# EAGLE design circuit (EAGLE 6.1)
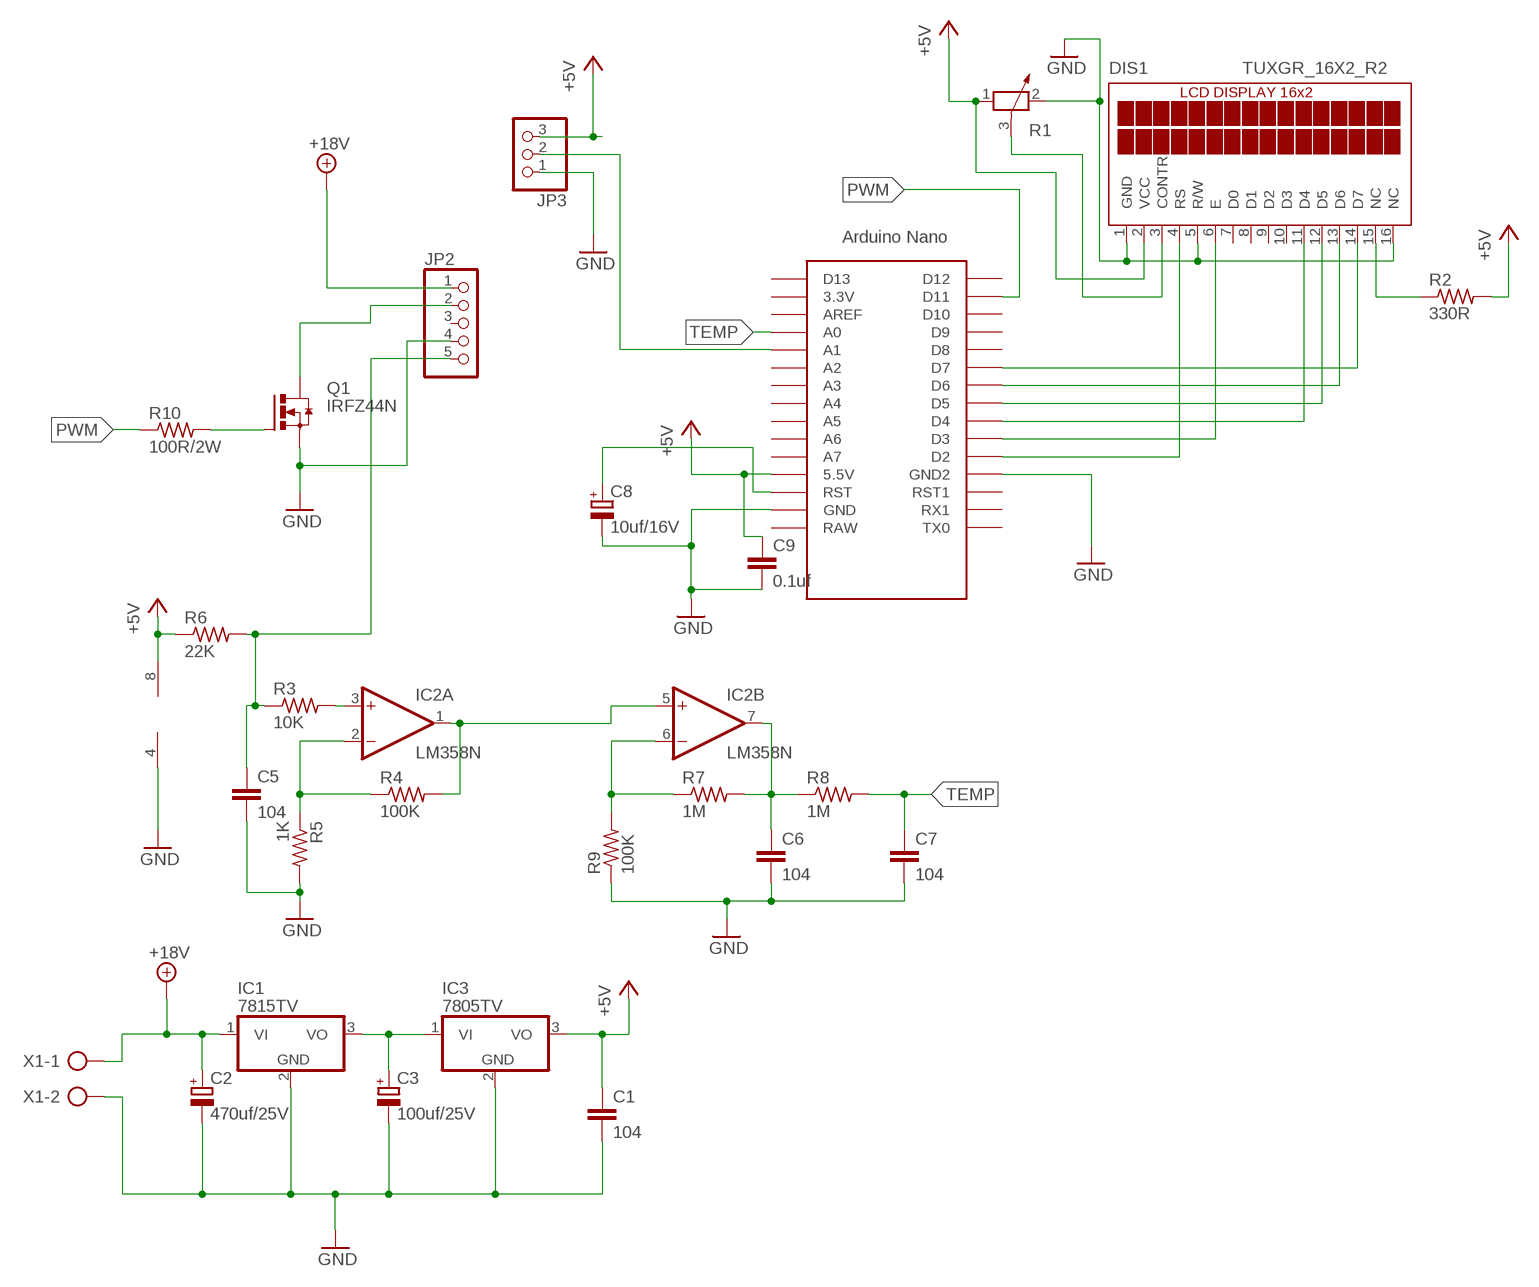
[diagram p0: schematic, sheet 1]

## Parts
C1  104  C-EU025-025X050  [C025-025X050]
C2  470uf/25V  CPOL-EUE2.5-7  [E2,5-7]
C3  100uf/25V  CPOL-EUE2.5-6  [E2,5-6]
C5  104  C-EU025-025X050  [C025-025X050]
C6  104  C-EU025-025X050  [C025-025X050]
C7  104  C-EU025-025X050  [C025-025X050]
C8  10uf/16V  CPOL-EUE2-5  [E2-5]
C9  0.1uf  C-EU025-040X050  [C025-040X050]
DIS1  TUXGR_16X2_R2  [TUXGR_16X2_R2]
IC1  7815TV  [TO220V]
IC2  LM358N  [DIL08]
IC3  7805TV  [TO220V]
JP2  PINHD-1X5  [1X05]
JP3  PINHD-1X3  [1X03]
Q1  IRFZ44N  [TO220BV]
R1  POTENTIOMETER_PT-10  [PT-10]
R2  330R  R-US_0207/10  [0207/10]
R3  10K  R-US_0207/10  [0207/10]
R4  100K  R-US_0207/10  [0207/10]
R5  1K  R-US_0207/10  [0207/10]
R6  22K  R-US_0207/10  [0207/10]
R7  1M  R-US_0207/10  [0207/10]
R8  1M  R-US_0207/10  [0207/10]
R9  100K  R-US_0207/10  [0207/10]
R10  100R/2W  R-US_0411/15  [0411/15]
U$2  NANO  [NANO]
X1  AK500/2  [AK500/2]

## Nets
+5V: C1.1 C9.1 DIS1.2(VCC) IC2.8(P:V+) IC3.3(VO) JP3.3 R1.1 R2.2 R6.1 U$2.5V(5.5V)
+18V: C2.+ IC1.1(VI) JP2.1 X1.1
GND: C1.2 C2.- C3.- C5.2 C6.2 C7.2 C8.- C9.2 DIS1.1(GND) DIS1.5(R/W) DIS1.16(NC) IC1.2(GND) IC2.4(P:V-) IC3.2(GND) JP2.4 JP3.1 Q1.S R1.2 R5.2 R9.1 U$2.GND U$2.GND1(GND2) X1.2
N$1: JP2.2 Q1.D
N$2: IC2.1(A:OUT) IC2.5(B:+IN) R4.2
N$3: C3.+ IC1.3(VO) IC3.1(VI)
N$4: IC2.2(A:-IN) R4.1 R5.1
N$5: IC2.3(A:+IN) R3.2
N$6: DIS1.4(RS) U$2.D2
N$7: C5.1 JP2.5 R3.1 R6.2
N$8: JP3.2 U$2.A1
N$9: IC2.6(B:-IN) R7.1 R9.2
N$10: C6.1 IC2.7(B:OUT) R7.2 R8.1
N$11: Q1.G R10.2
N$12: DIS1.6(E) U$2.D3
N$14: C8.+ U$2.RST
N$16: DIS1.11(D4) U$2.D4
N$17: DIS1.12(D5) U$2.D5
N$18: DIS1.13(D6) U$2.D6
N$19: DIS1.14(D7) U$2.D7
N$20: DIS1.3(CONTR) R1.3
N$25: DIS1.15(NC) R2.1
PWM: R10.1 U$2.D11
TEMP: C7.1 R8.2 U$2.A0
Unconnected: DIS1.7(D0) DIS1.8(D1) DIS1.9(D2) DIS1.10(D3) JP2.3 U$2.3.3V U$2.A2 U$2.A3 U$2.A4 U$2.A5 U$2.A6 U$2.A7 U$2.AREF U$2.D8 U$2.D9 U$2.D10 U$2.D12 U$2.D13 U$2.ICSP1 U$2.ICSP2 U$2.ICSP3 U$2.ICSP4 U$2.ICSP5 U$2.ICSP6 U$2.RAW U$2.RST1 U$2.RX1 U$2.TX0

## Library data of the parts
C1 C5-C7 C9 = rcl:C-EU: CAPACITOR, European symbol
C2 C3 C8 = rcl:CPOL-EU: POLARIZED CAPACITOR, European symbol
DIS1 = display-lcd:TUXGR_16X2_R2: Tuxgraphics LCD display 16x2 characters reflective, without background light Source: tuxgr_12x2_r2.pdf; OC_FARNELL: unknown; OC_NEWARK: unknown
IC1 IC3 = linear:78*: Positive VOLTAGE REGULATOR Source: http://cache.national.com/ds/LM/LM78L05.pdf http://www.fairchildsemi.com/ds/LM/LM7805.pdf
IC2 = linear:LM358: OP AMP also LM158; LM258; LM2904 Source: http://cache.national.com/ds/LM/LM158.pdf
JP2 = pinhead:PINHD-1X5: PIN HEADER
JP3 = pinhead:PINHD-1X3: PIN HEADER
Q1 = transistor-power:IRFZ44N: Aims Interactive IRFZ44 TYPE
R1 = rcl:POTENTIOMETER_: Potentiometer
R2-R10 = rcl:R-US_: RESISTOR, American symbol
U$2 = Arduino-clone:NANO: Arduino Nano
X1 = con-ptr500:AK500/2: CONNECTOR; OC_FARNELL: unknown; OC_NEWARK: unknown

## Net classes
0 default: clearance 1 mm

## Board
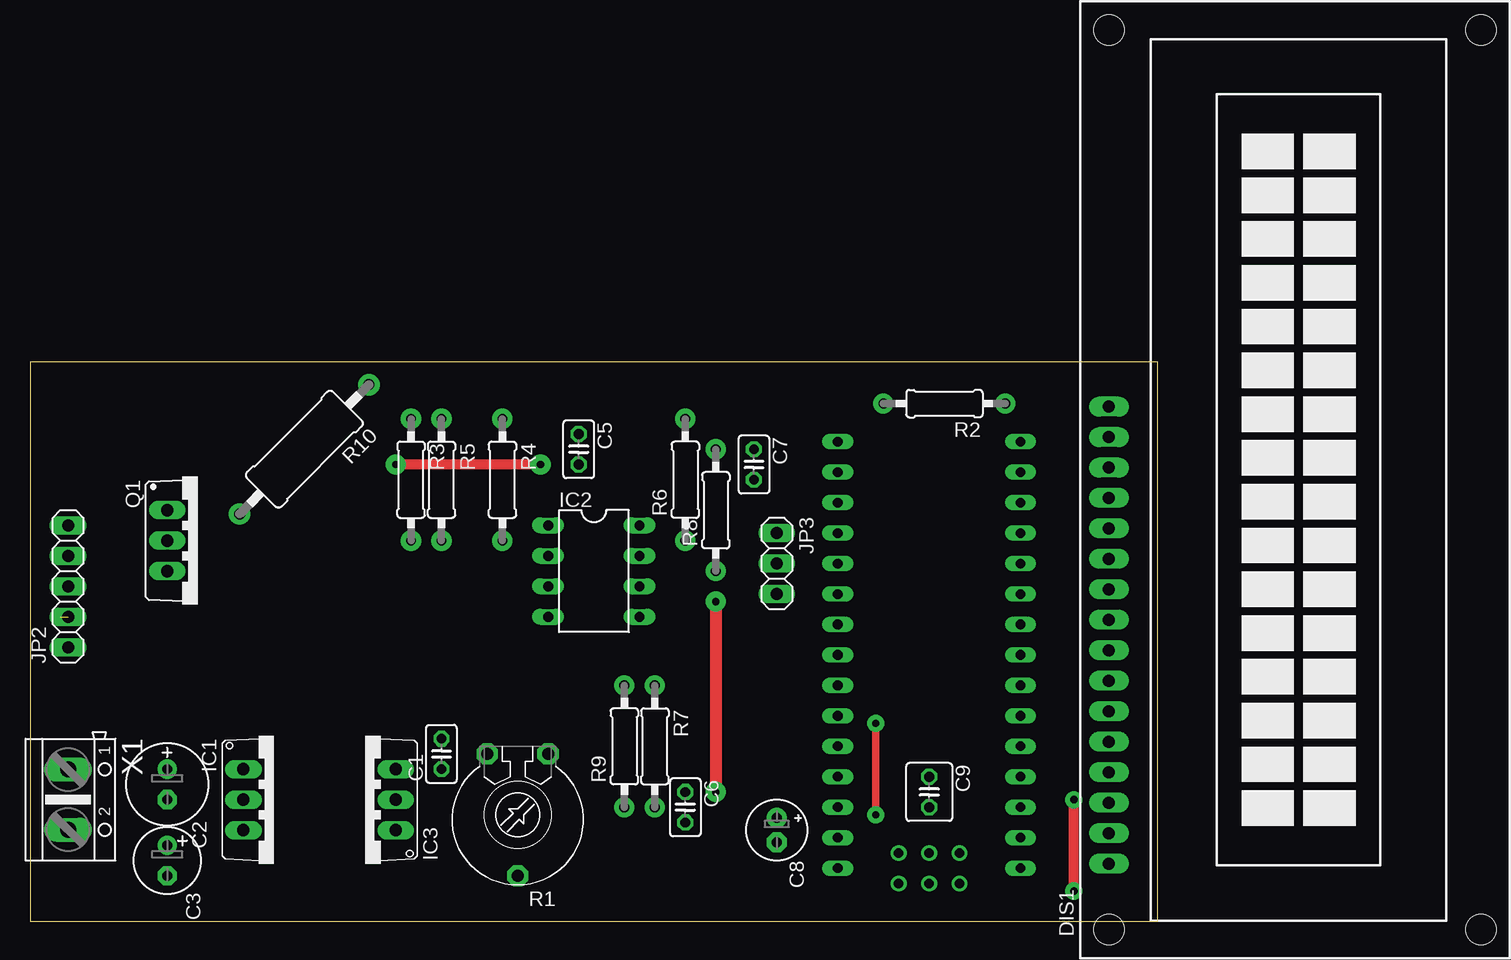
[diagram p1: board, top side]
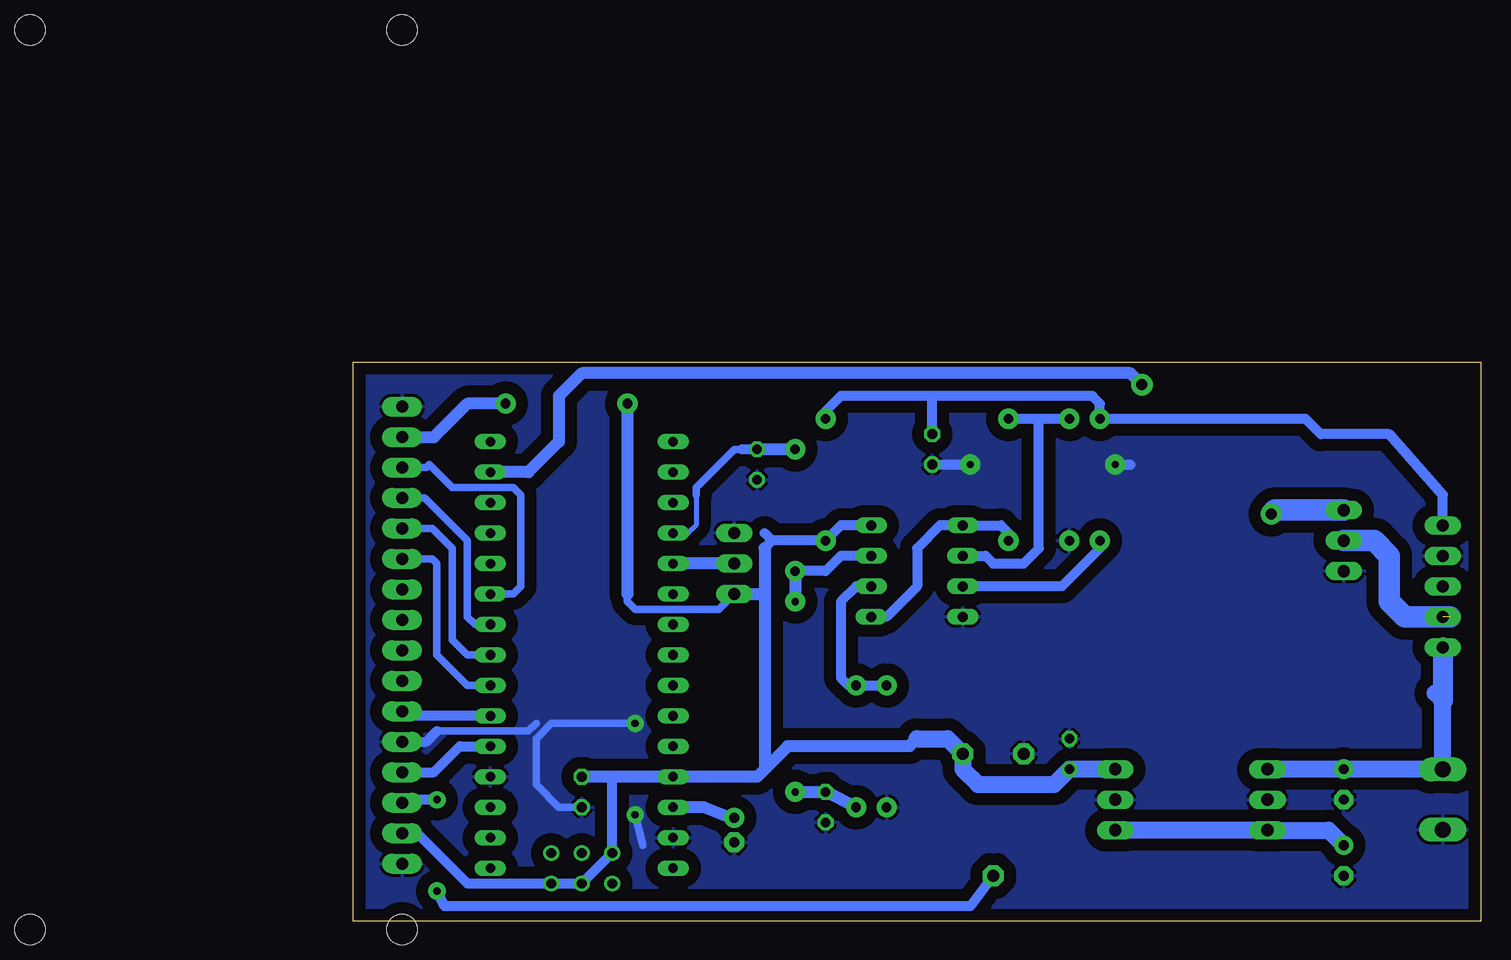
[diagram p2: board, bottom side, seen from below]

Size 93.96 x 46.66 mm. Coordinates in mm from the lower left corner, seen from the top.
Outline: 0,0 93.96,0 93.96,46.66 0,46.66 0,0
Copper layers (1*16): Top 0.035mm / dielectric 1.5mm / Bottom 0.035mm
Design rules: minimum track width 10mil, minimum drill 24mil, track to track 8mil, track to pad 8mil, pad to pad 8mil, via to via 8mil, smd to smd 8mil, copper to edge 40mil, drill to drill 8mil, minimum pad ring 10mil, minimum via ring 8mil, stop-mask expansion 4mil, vias tented up to drill 0mil, thermal gap 10mil

### Footprints (pad centres in the part's own frame; a part is rotated, then mirrored left to right if it is on the bottom)
C025-025X050 = drill 0.813 octagon: 1 -1.27,0; 2 1.27,0
E2,5-7 = drill 0.813 pad 1.6: + -1.27,0 | drill 0.813 pad 1.6 octagon: - 1.27,0
E2,5-6 = drill 0.813 pad 1.6: + -1.27,0 | drill 0.813 pad 1.6 octagon: - 1.27,0
E2-5 = drill 0.813 pad 1.676: + -1.016,0 | drill 0.813 pad 1.676 octagon: - 1.016,0
C025-040X050 = drill 0.813 octagon: 1 -1.27,0; 2 1.27,0
TUXGR_16X2_R2 = drill 1 pad 1.676 long: 1 -32,15.5; 2 -29.46,15.5; 3 -26.92,15.5; 4 -24.38,15.5; 5 -21.84,15.5; 6 -19.3,15.5; 7 -16.76,15.5; 8 -14.22,15.5; 9 -11.68,15.5; 10 -9.14,15.5; 11 -6.6,15.5; 12 -4.06,15.5; 13 -1.52,15.5; 14 1.02,15.5; 15 3.56,15.5; 16 6.1,15.5 | hole 2.5: -37.5,-15.5; 37.5,-15.5; -37.5,15.5; 37.5,15.5
TO220V = drill 1.016 long: 1 -2.54,-2.54; 2 0,-2.54; 3 2.54,-2.54
DIL08 = drill 0.813 pad 1.27 long: 1 -3.81,-3.81; 2 -1.27,-3.81; 3 1.27,-3.81; 4 3.81,-3.81; 5 3.81,3.81; 6 1.27,3.81; 7 -1.27,3.81; 8 -3.81,3.81
1X05 = drill 1.016 long: 1 -5.08,0; 2 -2.54,0; 3 0,0; 4 2.54,0; 5 5.08,0
1X03 = drill 1.016 long: 1 -2.54,0; 2 0,0; 3 2.54,0
TO220BV = drill 1.016 long: D 0,-2.54; G -2.54,-2.54; S 2.54,-2.54
PT-10 = drill 1.016 pad 1.778 octagon: 1 -2.54,-5.08; 2 2.54,-5.08; 3 0,5.08
0207/10 = drill 0.813 pad 1.676: 1 -5.08,0; 2 5.08,0
0411/15 = drill 0.914 pad 1.778: 1 -7.62,0; 2 7.62,0
NANO = drill 0.8 long: 3.3V -10.16,24.13; 5V -10.16,-1.27; A0 -10.16,19.05; A1 -10.16,16.51; A2 -10.16,13.97; A3 -10.16,11.43; A4 -10.16,8.89; A5 -10.16,6.35; A6 -10.16,3.81; A7 -10.16,1.27; AREF -10.16,21.59; D2 5.08,1.27; D3 5.08,3.81; D4 5.08,6.35; D5 5.08,8.89; D6 5.08,11.43; D7 5.08,13.97; D8 5.08,16.51; D9 5.08,19.05; D10 5.08,21.59; D11 5.08,24.13; D12 5.08,26.67; D13 -10.16,26.67; GND -10.16,-6.35; GND1 5.08,-1.27; RAW -10.16,-8.89; RST -10.16,-3.81; RST1 5.08,-3.81; RX1 5.08,-6.35; TX0 5.08,-8.89 | drill 0.8: ICSP1 -5.08,-10.16; ICSP2 -5.08,-7.62; ICSP3 -2.54,-10.16; ICSP4 -2.54,-7.62; ICSP5 0,-10.16; ICSP6 0,-7.62
AK500/2 = drill 1.321 long: 1 -2.515,0; 2 2.515,0

### Placement (x,y rotation side)
C1  34.29,13.97 90 top
C2  11.43,11.43 270 top
C3  11.43,5.08 270 top
C5  45.72,39.37 270 top
C6  54.61,9.53 270 top
C7  60.33,38.1 270 top
C8  62.23,7.62 270 top
C9  74.93,10.79 270 top
DIS1  105.41,36.83 90 top
IC1  20.32,10.16 270 top
IC2  46.99,29.21 270 top
IC3  27.94,10.16 90 top
JP2  3.17,27.94 90 top
JP3  62.23,29.84 270 top
Q1  13.97,31.75 270 top
R1  40.64,8.89 180 top
R2  76.2,43.18 180 top
R3  31.75,36.83 270 top
R4  39.37,36.83 270 top
R5  34.29,36.83 270 top
R6  54.61,36.83 90 top
R7  52.07,14.61 270 top
R8  57.15,34.29 90 top
R9  49.53,14.61 90 top
R10  22.86,39.37 225 top
U$2  77.47,13.34 0 top
X1  3.17,10.16 270 top

### Tracks (layer width: path | path; a pad name or v marks a point on that pad's centre or on a via)
+5V
  Bottom 0.61: 71.12,27.3 71.12,26.67 70.48,26.04 63.5,26.04 JP3.3
  Bottom 0.813: IC2.8 53.34,33.02 R6.1 59.05,31.75 | 59.05,31.75 59.69,31.11 | 59.69,32.38 59.05,31.75 | DIS1.2 88.65,7.37 84.45,3.17 74.93,3.17 72.39,5.71 72.39,12.06
  Bottom 1.016: 46.99,15.24 47.62,14.61 57.78,14.61 59.69,12.7 | 59.69,31.11 59.69,27.3 | 59.69,27.3 59.69,12.7 | 59.69,12.7 60.33,12.06 U$2.5V 72.39,12.06 C9.1 | JP3.3 59.69,27.3 | R2.2 71.12,27.3
  Bottom 1.422: IC3.3 C1.1 35.56,11.43 41.91,11.43 43.18,12.7 R1.1 44.45,15.24 46.99,15.24
+18V
  Bottom 1.422: 3.81,19.05 3.17,18.41 X1.1 11.4,12.68 C2.+ IC1.1
  Bottom 1.676: JP2.1 3.17,18.41
GND  (via drill 0.6 pad 1.42, 0.6 pad 1.68)
  Top 0.61: v70.48,16.51 v70.48,8.89
  Top 0.813: v42.55,38.1 v30.48,38.1
  Bottom 0.61: 87,15.88 79.38,15.88 78.74,16.51 | C9.2 76.83,9.53 78.74,11.43 78.74,15.24 77.47,16.51 v70.48,16.51 | v70.48,8.89 69.85,6.35
  Bottom 0.813: C5.2 v42.55,38.1 | v30.48,38.1 29.21,38.1 | DIS1.5 87.88,14.99 87,15.88
  pour Bottom: 0,46.99 0,0 93.98,0 93.98,46.99
N$1  (1 unrouted)
  Bottom 1.778: Q1.D 8.89,31.75 7.62,30.48 7.62,26.67 6.35,25.4 2.54,25.4
N$2
  Bottom 0.813: IC2.5 49.53,25.4 46.99,27.94 46.99,31.11 45.09,33.02 IC2.1 40.01,33.02 39.37,32.38 R4.2
N$3
  Bottom 1.422: C3.+ 12.7,7.62 IC1.3 IC3.1
N$4
  Bottom 0.813: R5.1 36.83,41.91 | 36.83,41.91 R4.1 | IC2.2 41.27,30.48 40.64,29.84 38.1,29.84 36.83,31.11 36.83,41.91
N$5
  Bottom 0.813: R3.2 31.75,31.11 34.92,27.94 IC2.3
N$6
  Bottom 0.813: DIS1.4 87.25,12.45 85.09,14.61 U$2.D2
N$7
  Bottom 0.813: 45.72,43.81 32.38,43.81 31.75,43.18 R3.1 14.61,41.91 13.34,40.64 7.62,40.64 3.17,35.56 JP2.5 | 45.72,43.81 53.34,43.81 54.61,42.55 R6.2 | C5.1 45.72,43.81
N$8
  Bottom 1.016: JP3.2 U$2.A1
N$9
  Bottom 0.813: IC2.6 52.07,27.94 53.34,26.67 53.34,20.32 52.7,19.68 R7.1 R9.2
N$10  (via drill 0.6 pad 1.68)
  Top 1.016: v57.15,26.67 v57.15,10.79
  Bottom 0.813: IC2.7 53.34,30.48 54.61,29.21 R8.1
  Bottom 1.016: R7.2 C6.1 v57.15,10.79 | R8.1 v57.15,26.67
N$11
  Bottom 1.778: Q1.G 17.16,34.29 R10.2
N$12
  Bottom 0.813: U$2.D3 89.53,17.14 DIS1.6
N$14
  Bottom 1.016: C8.+ 62.61,8.64 64.77,9.53 U$2.RST
N$16
  Bottom 0.61: DIS1.11 87.38,30.23 87,29.84 87,22.23 84.45,19.68 U$2.D4 81.92,19.68
N$17
  Bottom 0.61: DIS1.12 87.38,32.77 85.72,31.11 85.72,23.5 84.45,22.23 U$2.D5
N$18
  Bottom 0.61: U$2.D6 83.82,24.77 84.45,25.4 84.45,31.75 88.02,35.31 DIS1.13
N$19
  Bottom 0.61: U$2.D7 80.64,27.3 80.01,27.94 80.01,35.56 80.64,36.2 85.72,36.2 87.63,38.1 87.88,37.85 DIS1.14
N$20  (via drill 0.6 pad 1.42)
  Top 0.813: v87,2.54 v87,10.16
  Bottom 0.813: R1.3 42.55,1.27 86.36,1.27 v87,2.54 | v87,10.16 89.66,10.16 DIS1.3
N$25
  Bottom 1.016: R2.1 84.45,43.18 87.25,40.39 DIS1.15
PWM
  Bottom 1.016: R10.1 29.21,45.72 74.93,45.72 76.83,43.81 76.83,40.01 79.38,37.47 U$2.D11
TEMP
  Bottom 0.406: 65.41,35.56 65.41,33.02 66.04,32.38 U$2.A0
  Bottom 0.61: 61.59,39.37 62.23,39.37 65.41,36.2 65.41,35.56
  Bottom 0.813: C7.1 61.59,39.37
  Bottom 1.016: R8.2 C7.1